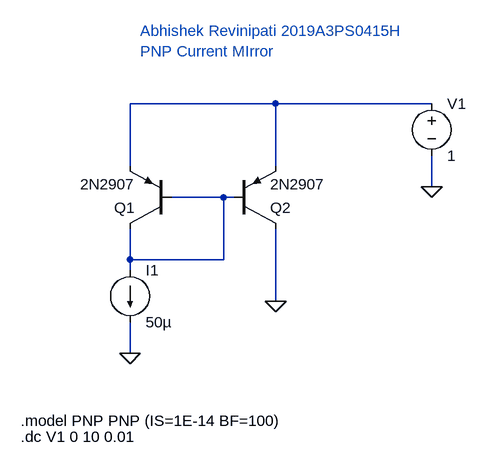
[diagram p0: schematic 2019A3PS0415H_PNP_CM.asc]
2019A3PS0415H_PNP_CM.asc, the LTspice schematic file:
Version 4
SHEET 1 1052 680
WIRE 144 -16 -80 -16
WIRE 384 -16 144 -16
WIRE -80 80 -80 -16
WIRE 144 80 144 -16
WIRE 384 112 384 64
WIRE 64 128 -16 128
WIRE 80 128 64 128
WIRE -80 224 -80 176
WIRE 64 224 64 128
WIRE 64 224 -80 224
WIRE -80 240 -80 224
WIRE 144 288 144 176
WIRE -80 368 -80 320
FLAG 384 112 0
FLAG -80 368 0
FLAG 144 288 0
SYMBOL voltage 384 -32 R0
WINDOW 123 0 0 Left 2
WINDOW 39 0 0 Left 2
SYMATTR InstName V1
SYMATTR Value 1
SYMBOL pnp -16 176 R180
SYMATTR InstName Q1
SYMATTR Value 2N2907
SYMBOL pnp 80 176 M180
SYMATTR InstName Q2
SYMATTR Value 2N2907
SYMBOL current -80 240 R0
WINDOW 123 0 0 Left 2
WINDOW 39 0 0 Left 2
SYMATTR InstName I1
SYMATTR Value 50µ
TEXT -248 472 Left 2 !.model PNP PNP (IS=1E-14 BF=100)
TEXT -248 496 Left 2 !.dc V1 0 10 0.01
TEXT -64 -128 Left 2 ;Abhishek Revinipati 2019A3PS0415H\nPNP Current MIrror

The netlist it stands for:
* 2019A3PS0415H_PNP_CM.asc
V1 N001 0 1
Q1 N002 N002 N001 0 2N2907
Q2 0 N002 N001 0 2N2907
I1 N002 0 50µ
.model NPN NPN
.model PNP PNP
.lib standard.bjt
.model PNP PNP (IS=1E-14 BF=100)
.dc V1 0 10 0.01
* Abhishek Revinipati 2019A3PS0415H
* PNP Current MIrror
.backanno
.end